# Altium schematic sheet MAX30003.SchDoc
size A4
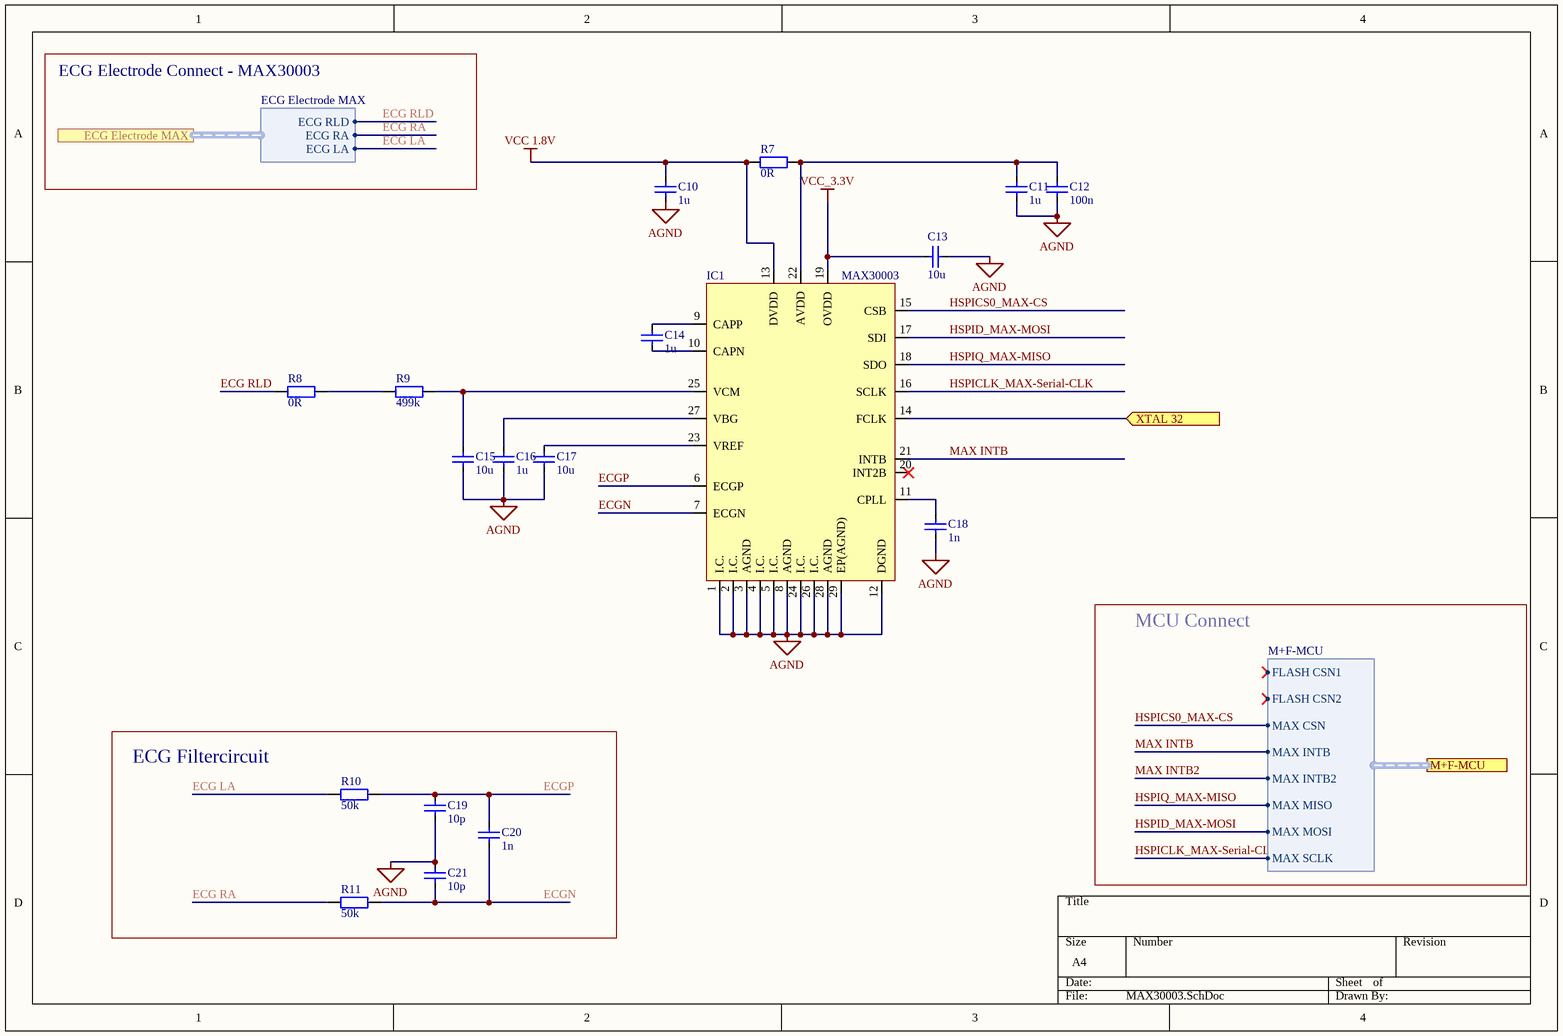
[diagram p0: MAX30003.SchDoc]

## Parts
C10  1u  [CAPC1005X03N]
C11  1u  [CAPC1005X03N]
C12  100n  [CAPC1005X03N]
C13  10u  [CAPC1608X05N]
C14  1u  [CAPC1005X03N]
C15  10u  [CAPC1608X05N]
C16  1u  [CAPC1005X03N]
C17  10u  [CAPC1608X05N]
C18  1n  [CAPC1005X03N]
C19  10p  [CAPC1005X03N]
C20  1n  [CAPC1005X03N]
C21  10p  [CAPC1005X03N]
IC1  MAX30003  [MAX30003CTI+T2855-8]
R7  0R  [RESC1005X03N]
R8  0R  [RESC1005X03N]
R9  499k  [RESC1005X03N]
R10  50k  [RESC1005X03N]
R11  50k  [RESC1005X03N]

## Blocks framed on the sheet
ECG Filtercircuit: C19-C21 R10 R11

## Ports
ECG Electrode MAX (harness ECG Electrode MAX), M+F-MCU (harness M+F-MCU), XTAL 32 (in)

## Harnesses
ECG Electrode MAX: ECG LA, ECG RA, ECG RLD
M+F-MCU: FLASH CSN1, FLASH CSN2, MAX CSN, MAX INTB, MAX INTB2, MAX MISO, MAX MOSI, MAX SCLK

## Nets
AGND: C10.1 C11.1 C12.1 C13.2 C15.1 C16.1 C17.1 C18.1 C19.1 C21.2 IC1.1(I.C.) IC1.2(I.C.) IC1.3(AGND) IC1.4(I.C.) IC1.5(I.C.) IC1.8(AGND) IC1.12(DGND) IC1.24(I.C.) IC1.26(I.C.) IC1.28(AGND) IC1.29(EP(AGND))
VCC 1.8V: C10.2 IC1.13(DVDD) R7.1
VCC_3.3V: C13.1 IC1.19(OVDD)
ECG LA: R10.1 ; port ECG Electrode MAX.ECG LA
ECG RA: R11.1 ; port ECG Electrode MAX.ECG RA
ECG RLD: R8.1 ; port ECG Electrode MAX.ECG RLD
ECGN: C20.1 C21.1 IC1.7(ECGN) R11.2
ECGP: C19.2 C20.2 IC1.6(ECGP) R10.2
HSPICLK_MAX-Serial-CLK: IC1.16(SCLK) ; port M+F-MCU.MAX SCLK
HSPICS0_MAX-CS: IC1.15(CSB) ; port M+F-MCU.MAX CSN
HSPID_MAX-MOSI: IC1.17(SDI) ; port M+F-MCU.MAX MOSI
HSPIQ_MAX-MISO: IC1.18(SDO) ; port M+F-MCU.MAX MISO
MAX INTB: IC1.21(INTB) ; port M+F-MCU.MAX INTB
MAX INTB2: port M+F-MCU.MAX INTB2
XTAL 32: IC1.14(FCLK) ; port XTAL 32
NetC11_2: C11.2 C12.2 IC1.22(AVDD) R7.2
NetC14_1: C14.1 IC1.10(CAPN)
NetC14_2: C14.2 IC1.9(CAPP)
NetC15_2: C15.2 IC1.25(VCM) R9.2
NetC16_2: C16.2 IC1.27(VBG)
NetC17_2: C17.2 IC1.23(VREF)
NetC18_2: C18.2 IC1.11(CPLL)
NetR8_2: R8.2 R9.1

Not connected (* = marked no-connect by the designer): IC1 20(INT2B)*

## Notes on the sheet
- ECG Electrode Connect - MAX30003
- MCU Connect

## Library data of the parts
C10 C11 C14 C16 = C_1u_6V3_0402: Kondensator 1u 6V3 0402; Tested: False; Supplier 1: Farnell; Supplier Part Number 1: 2672114
C12 = C_100n_50V_0402: Kondensator 100n 50V 0402; Tested: False; Supplier 1: Farnell; Supplier Part Number 1: 2210822
C13 C15 C17 = C_10u_10V_0603: Kondensator 10u 10V 0603; Supplier 1: Farnell; Supplier Part Number 1: 2521952
C18 C20 = C_1n_50V_0402: Kondensator 1n 50V 0402; Tested: False; Supplier 1: Digikey; Supplier Part Number 1: 399-10034-1-ND
C19 C21 = C_10p_25V_NP0_0402: Kondensator 10p 25V NP0 0402; Tested: False; Supplier 1: Mouser; Supplier Part Number 1: 710-885012005040
IC1 = MAX30003CTI+
R7 R8 = R_0R_0402: Widerstand 0R 0402; Tested: True; Supplier 1: Farnell; Supplier Part Number 1: 2059190
R9 = R_0402: Widerstand 0402; Tested: False
R10 R11 = R_0R_0402: Widerstand 50k 0402; Tested: True; Supplier 1: Farnell; Supplier Part Number 1: 2059190